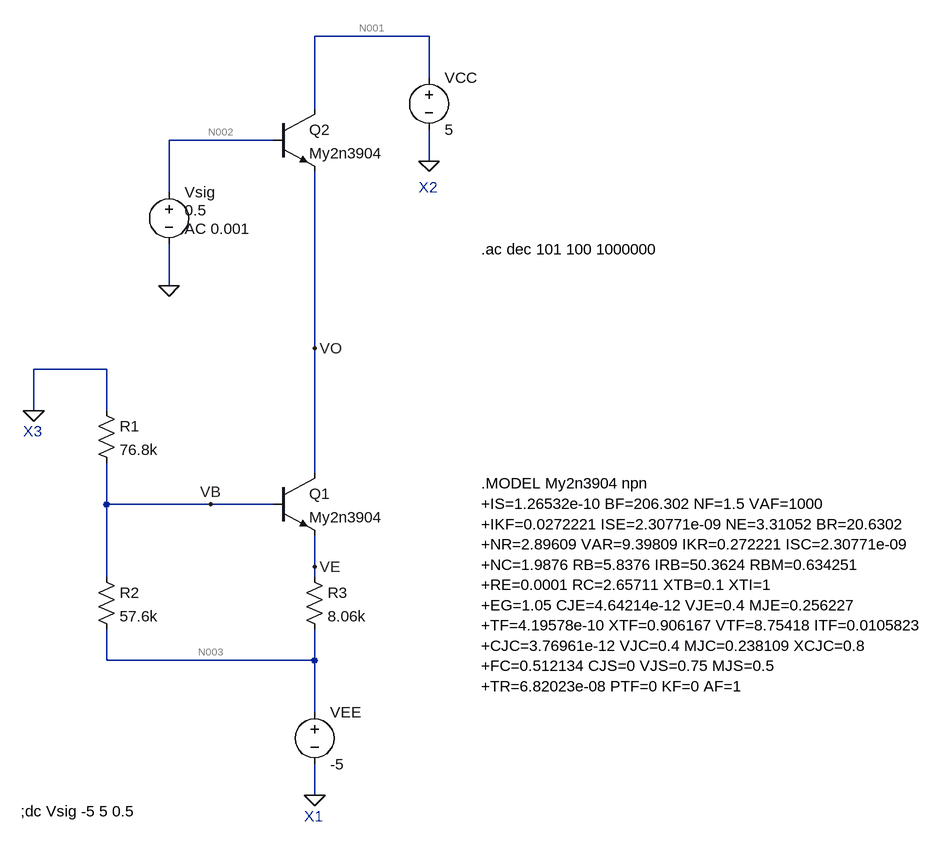
[diagram p0: schematic A.asc]
A.asc, the LTspice schematic file:
Version 4
SHEET 1 1352 680
WIRE 528 -656 352 -656
WIRE 528 -592 528 -656
WIRE 352 -544 352 -656
WIRE 288 -496 128 -496
WIRE 528 -464 528 -512
WIRE 128 -416 128 -496
WIRE 128 -272 128 -336
WIRE 352 -176 352 -448
WIRE 32 -144 -80 -144
WIRE -80 -80 -80 -144
WIRE 32 -80 32 -144
WIRE 352 16 352 -176
WIRE 32 64 32 0
WIRE 192 64 32 64
WIRE 288 64 192 64
WIRE 352 160 352 112
WIRE 32 176 32 64
WIRE 352 176 352 160
WIRE 32 304 32 256
WIRE 352 304 352 256
WIRE 352 304 32 304
WIRE 352 384 352 304
WIRE 352 512 352 464
FLAG -80 -80 0
FLAG 352 512 0
FLAG 128 -272 0
FLAG 528 -464 0
FLAG 192 64 VB
FLAG 352 -176 VO
FLAG 352 160 VE
SYMBOL res 16 -96 R0
SYMATTR InstName R1
SYMATTR Value 76.8k
SYMBOL res 16 160 R0
SYMATTR InstName R2
SYMATTR Value 57.6k
SYMBOL res 336 160 R0
SYMATTR InstName R3
SYMATTR Value 8.06k
SYMBOL voltage 352 368 R0
WINDOW 123 0 0 Left 0
WINDOW 39 0 0 Left 0
SYMATTR InstName VEE
SYMATTR Value -5
SYMBOL npn 288 16 R0
SYMATTR InstName Q1
SYMATTR Value My2n3904
SYMBOL npn 288 -544 R0
SYMATTR InstName Q2
SYMATTR Value My2n3904
SYMBOL voltage 128 -432 R0
WINDOW 3 24 44 Left 2
WINDOW 123 24 72 Left 2
WINDOW 39 0 0 Left 0
SYMATTR InstName Vsig
SYMATTR Value 0.5
SYMATTR Value2 AC 0.001
SYMBOL voltage 528 -608 R0
WINDOW 123 0 0 Left 0
WINDOW 39 0 0 Left 0
SYMATTR InstName VCC
SYMATTR Value 5
TEXT 608 32 Left 2 !.MODEL My2n3904 npn\n+IS=1.26532e-10 BF=206.302 NF=1.5 VAF=1000\n+IKF=0.0272221 ISE=2.30771e-09 NE=3.31052 BR=20.6302\n+NR=2.89609 VAR=9.39809 IKR=0.272221 ISC=2.30771e-09\n+NC=1.9876 RB=5.8376 IRB=50.3624 RBM=0.634251\n+RE=0.0001 RC=2.65711 XTB=0.1 XTI=1\n+EG=1.05 CJE=4.64214e-12 VJE=0.4 MJE=0.256227\n+TF=4.19578e-10 XTF=0.906167 VTF=8.75418 ITF=0.0105823\n+CJC=3.76961e-12 VJC=0.4 MJC=0.238109 XCJC=0.8\n+FC=0.512134 CJS=0 VJS=0.75 MJS=0.5\n+TR=6.82023e-08 PTF=0 KF=0 AF=1
TEXT -100 536 Left 2 !;dc Vsig -5 5 0.5
TEXT 512 -424 Left 2 ;X2
TEXT -96 -48 Left 2 ;X3
TEXT 336 544 Left 2 ;X1
TEXT 608 -328 Left 2 !.ac dec 101 100 1000000

The netlist it stands for:
* A.asc
R1 0 VB 76.8k
R2 VB N003 57.6k
R3 VE N003 8.06k
VEE N003 0 -5
Q1 VO VB VE 0 My2n3904
Q2 N001 N002 VO 0 My2n3904
Vsig N002 0 0.5 AC 0.001
VCC N001 0 5
.model NPN NPN
.model PNP PNP
.lib standard.bjt
.MODEL My2n3904 npn
+IS=1.26532e-10 BF=206.302 NF=1.5 VAF=1000
+IKF=0.0272221 ISE=2.30771e-09 NE=3.31052 BR=20.6302
+NR=2.89609 VAR=9.39809 IKR=0.272221 ISC=2.30771e-09
+NC=1.9876 RB=5.8376 IRB=50.3624 RBM=0.634251
+RE=0.0001 RC=2.65711 XTB=0.1 XTI=1
+EG=1.05 CJE=4.64214e-12 VJE=0.4 MJE=0.256227
+TF=4.19578e-10 XTF=0.906167 VTF=8.75418 ITF=0.0105823
+CJC=3.76961e-12 VJC=0.4 MJC=0.238109 XCJC=0.8
+FC=0.512134 CJS=0 VJS=0.75 MJS=0.5
+TR=6.82023e-08 PTF=0 KF=0 AF=1
;dc Vsig -5 5 0.5
* X2
* X3
* X1
.ac dec 101 100 1000000
.backanno
.end

* Results of the author's LTspice run, read from the files saved beside the schematic
* Operating Point, zero values left out:
*   V(vb) = -2.937 V
*   V(n003) = -5 V
*   V(ve) = -3.49 V
*   V(vo) = -52.66 mV
*   V(n001) = 5 V
*   V(n002) = 500 mV
*   Ic(Q2) = 182.5 µA
*   Ib(Q2) = 2.404 µA
*   Ie(Q2) = -184.9 µA
*   Ic(Q1) = 184.9 µA
*   Ib(Q1) = 2.428 µA
*   Ie(Q1) = -187.3 µA
*   I(R3) = 187.3 µA
*   I(R2) = 35.82 µA
*   I(R1) = 38.24 µA
*   I(Vcc) = -182.5 µA
*   I(Vsig) = -2.404 µA
*   I(Vee) = 223.1 µA
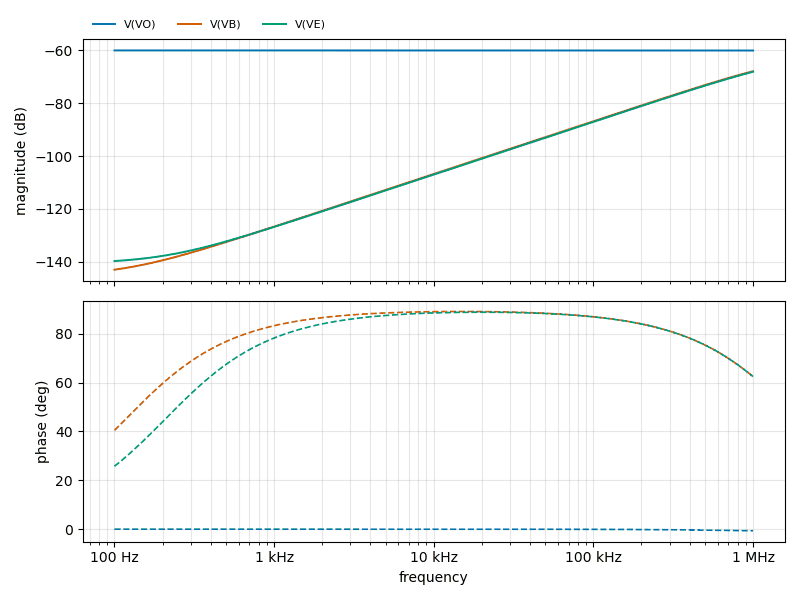
[diagram p1: AC Analysis of A.asc, plotted from the saved traces]
* AC Analysis, 1 run:
*   V(VO): -60.00 dB at 100 Hz, -60.05 dB at 1 MHz, peak -60.00 dB at 100 Hz
*   V(VB): -143.06 dB at 100 Hz, -67.87 dB at 1 MHz, peak -67.87 dB at 1 MHz, 3 dB below the peak at 663.1 kHz
*   V(VE): -139.79 dB at 100 Hz, -68.09 dB at 1 MHz, peak -68.09 dB at 1 MHz, 3 dB below the peak at 663.1 kHz